# Altium project StratoChovy.PrjPcb (part 2 of 2)

## Sheet GPS.SchDoc
size A
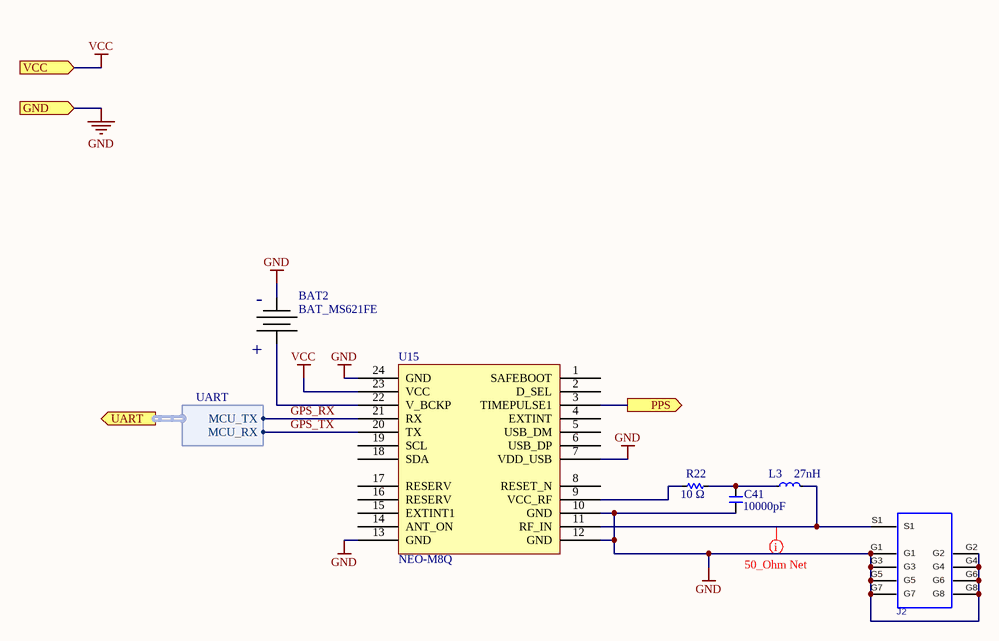
[diagram p6: GPS.SchDoc]

### Parts
BAT2  BAT_MS621FE  [BATT_COINCELL_RECHARGEABLE]
C41  Capacitance (shorthand): 10000pF  [C0603]  (hidden comment: 490-1512-1-ND)
J2  SMA-J-P-X-ST-EM2  [SMA-J-P-X-ST-EM1]  (value not drawn)
L3  Inductance: 27nH  [R0402]  (hidden comment: 490-15373-1-ND)
R22  Resistance: 10 Ω  [R0603]  (hidden comment: 311-10.0HRCT-ND)
U15  NEO-M8Q  [NEO_M8]

### Ports
GND (in), PPS (out), UART (out, harness UART), VCC (in)

### Harnesses
UART: MCU_RX, MCU_TX

### Nets
GND: BAT2.- C41.1 J2.G1 J2.G2 J2.G3 J2.G4 J2.G5 J2.G6 J2.G7 J2.G8 U15.7(VDD_USB) U15.10(GND) U15.12(GND) U15.13(GND) U15.24(GND) ; port GND
VCC: U15.23(VCC) ; port VCC  [project net 3V3]
GPS_RX: U15.21(RX) ; port UART.MCU_TX
GPS_TX: U15.20(TX) ; port UART.MCU_RX
PPS: U15.3(TIMEPULSE1) ; port PPS
NetBAT2_+: BAT2.+ U15.22(V_BCKP)
NetC41_2: C41.2 L3.1 R22.2
NetJ2_S1: J2.S1 L3.2 U15.11(RF_IN)
NetR22_1: R22.1 U15.9(VCC_RF)

Not connected (* = marked no-connect by the designer): U15 1(SAFEBOOT) 2(D_SEL) 4(EXTINT) 5(USB_DM) 6(USB_DP) 8(RESET_N) 14(ANT_ON) 15(EXTINT1) 16(RESERV) 17(RESERV) 18(SDA) 19(SCL)

### Layout directives
rule Clearance Constraint [Generic clearance = 0mil, and 21 value(s) for objects]: NetJ2_S1

### Library data of the parts
BAT2 = CMP-060-0000-1: MS621FE RECHARGEABLE COIN CELL BACKUP; Manufacturer: Seiko Instruments; Manufacturer Part Number: MS621FE-FL11E; Battery Chemistry: Lithium; Battery Cell Size: Coin, 6.8mm; Capacity: 5.5mAh; Discharge Rate: 15µA; Shipping Info: Due to restrictions, only ground shipment is allowed.; RoHS: RoHS Compliant; Stock 1: 41059; Pricing 1: 1=2.04, 10=1.838, 50=1.6338, 100=1.4296, 250=1.30704, 500=1.22534, 1000=1.09051, 2500=1.0112, 5000=0.99138 (USD); Part Status: Active; Size / Dimension: 0.27" Dia x 0.08" H (6.8mm x 2.1mm); Termination Style: SMD (SMT) Tab; Standard Charge Current: 15µA; Standard Charge Time: -; Weight: 0.23g; ComponentLink1URL: http://www.sii.co.jp/en/me/files/2017/04/MicroBatteryCatalogue-E_2017_web.pdf; ComponentLink1Description: http://www.sii.co.jp/en/me/files/2017/04/MicroBatteryCatalogue-E_2017_web.pdf; Design Item ID: BAT_MS621FE; Source: miscellaneous.SchLib
C41 = CMP-119-0053-1: CAP CER 0603 10000pF X7R 50V 10%; Manufacturer: Murata Electronics North America; Capacitance - pF (Machine readable): #NAME?; Rated Voltage: 50V; Dielectric: X7R
J2 = CMP-025-0000-1: SMA Samtec, Edge Mount, Long Thread. PCB Footprint designed by timv to improve strength, verifived on several PCBs from BAC.
L3 = CMP-123-0062-1: FIXED IND 27NH 680MA 288 MOHM; Manufacturer: Murata Electronics North America; Frequency - Self Resonant: 4GHz; Inductance - nH (Machine readable): 27; Current Rating: 680mA
R22 = CMP-126-0002-2: RES SMD 10 OHM 1% 1/10W 0603; Manufacturer: Yageo; Manufacturer Part Number: RC0603FR-0710RL; Temperature Coefficient: ±200ppm/°C; Resistance (Sortable): 10; Power (Watts): 0.1W, 1/10W; Tolerance: ±1%; Operating Temperature: -55°C ~ 155°C; Image: //media.digikey.com/Renders/Yageo%20Renders/0603-(1608-Metric).jpg; Datasheets: http://www.yageo.com/documents/recent/PYu-RC_Group_51_RoHS_L_9.pdf
U15 = CMP-074-0003-2: Receiver GNSS 24LCC; Design Item ID: NEO_M8; Source: sensor.SchLib

## Sheet COTS_Altimeter.SchDoc
size A3
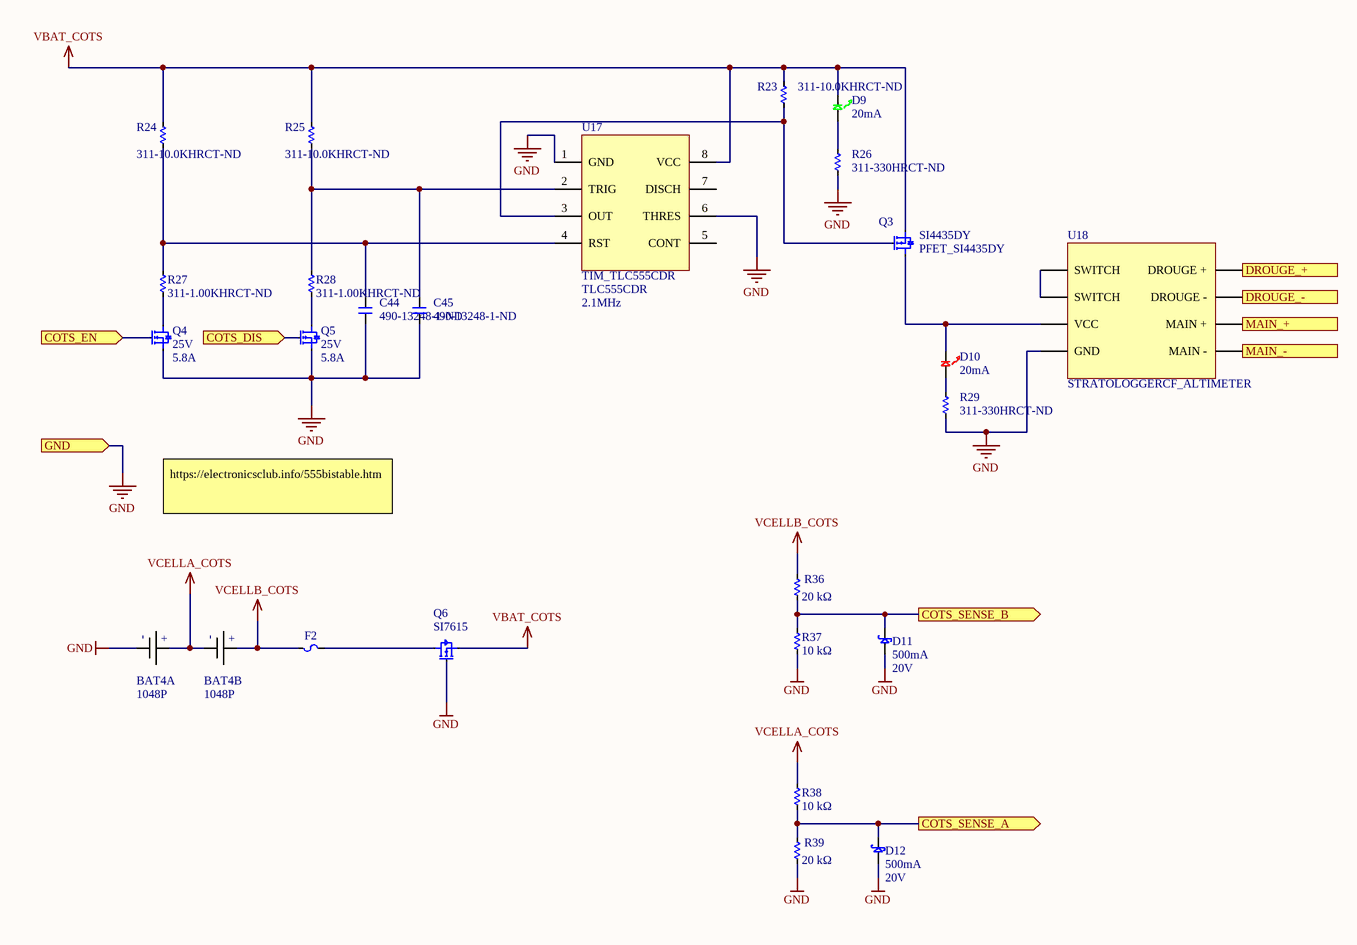
[diagram p7: COTS_Altimeter.SchDoc]

### Parts
(Parts that share a designator on the sheet are numbered #1, #2 ... from top to bottom, then left to right.)
BAT4  Manufacturer Part Number: 1048P  [BATT_18650_KEYSTONE_1048]  (hidden comment: BATT_Clip_Li-Ion_2x)  (parts A,B of 2)
C44  490-13248-1-ND  [C0603]
C45#1  490-13248-1-ND  [C0603]
D9  Current - Test: 20mA  [0805_Diode]  (hidden comment: LED_LY971)
D10  Current - Test: 20mA  [0805_Diode]  (hidden comment: LED_LY974)
D11  Current - Average Rectified (Io): 500mA  Voltage - DC Reverse (Vr) (Max): 20V  [SOD123]  (hidden comment: SCHOTTKY_MBR0520L)
D12  Current - Average Rectified (Io): 500mA  Voltage - DC Reverse (Vr) (Max): 20V  [SOD123]  (hidden comment: SCHOTTKY_MBR0520L)
F2  __template_fuse  [R1206]  (value not drawn)
Q3  PFET_SI4435DY  Manufacturer Part Number: SI4435DY  [8SOIC300]
Q4  Drain to Source Voltage (Vdss): 25V  Current - Continuous Drain (Id) @ 25° C: 5.8A  [3SOT23]  (hidden comment: NFET_IRFML8244TRPBF)
Q5  Drain to Source Voltage (Vdss): 25V  Current - Continuous Drain (Id) @ 25° C: 5.8A  [3SOT23]  (hidden comment: NFET_IRFML8244TRPBF)
Q6  SI7615  [POWERPAK_1212-8_SINGLE]
R23  311-10.0KHRCT-ND  [R0603]
R24  311-10.0KHRCT-ND  [R0603]
R25  311-10.0KHRCT-ND  [R0603]
R26  311-330HRCT-ND  [R0603]
R27  311-1.00KHRCT-ND  [R0603]
R28  311-1.00KHRCT-ND  [R0603]
R29  311-330HRCT-ND  [R0603]
R36  Resistance: 20 kΩ  [R0603]  (hidden comment: 311-20.0KHRCT-ND)
R37  Resistance: 10 kΩ  [R0603]  (hidden comment: 311-10.0KHRCT-ND)
R38  Resistance: 10 kΩ  [R0603]  (hidden comment: 311-10.0KHRCT-ND)
R39  Resistance: 20 kΩ  [R0603]  (hidden comment: 311-20.0KHRCT-ND)
U17  TIM_TLC555CDR  Manufacturer Part Number: TLC555CDR  Frequency: 2.1MHz  [8SOIC390]
U18#1  STRATOLOGGERCF_ALTIMETER  [STRATOLOGGER_ALTIMETER]

### Ports
COTS_DIS (in), COTS_EN (in), COTS_SENSE_A (out), COTS_SENSE_B (out), DROUGE_+ (out), DROUGE_- (out), GND (in), MAIN_+ (out), MAIN_- (out)

### Nets
GND: BAT4.CELL1- C44.2 C45#1.2 D11.1 D12.1 Q4.2 Q5.2 Q6.4 R26.1 R29.1 R37.1 R39.1 U17.1(GND) U17.6(THRES) U18#1.5(GND) ; port GND
VBAT_COTS: D9.1 Q3.1,2,3 Q6.1 R23.2 R24.2 R25.2 U17.8(VCC)
VCELLA_COTS: BAT4.CELL1+ BAT4.CELL2- R38.2
VCELLB_COTS: BAT4.CELL2+ F2.1 R36.2
COTS_DIS: Q5.1 ; port COTS_DIS
COTS_EN: Q4.1 ; port COTS_EN
COTS_SENSE_A: D12.2 R38.1 R39.2 ; port COTS_SENSE_A
COTS_SENSE_B: D11.2 R36.1 R37.2 ; port COTS_SENSE_B
DROUGE_+: U18#1.4(DROUGE_+) ; port DROUGE_+
DROUGE_-: U18#1.3(DROUGE_-) ; port DROUGE_-
MAIN_+: U18#1.2(MAIN_+) ; port MAIN_+
MAIN_-: U18#1.1(MAIN_-) ; port MAIN_-
NetC44_1: C44.1 R24.1 R27.2 U17.4(RST)
NetC45#1_1: C45#1.1 R25.1 R28.2 U17.2(TRIG)
NetD9_2: D9.2 R26.2
NetD10_1: D10.1 Q3.5,6,7,8 U18#1.6(VCC)
NetD10_2: D10.2 R29.2
NetF2_2: F2.2 Q6.5
NetQ3_4: Q3.4 R23.1 U17.3(OUT)
NetQ4_3: Q4.3 R27.1
NetQ5_3: Q5.3 R28.1
NetU18#1_7: U18#1.7(SWITCH) U18#1.8(SWITCH)

Not connected (* = marked no-connect by the designer): U17 5(CONT) 7(DISCH)

### Notes on the sheet
- https://electronicsclub.info/555bistable.htm
- (in symbol CMP-030-0028-1, part A) +
- (in symbol CMP-030-0028-1, part B) +

### Library data of the parts
BAT4 = CMP-030-0028-1: Dual Lithium Ion Cell Holder; Manufacturer: Keystone Electronics; Number of Cells: 2; Battery Type, Function: Cylindrical, Holder; Battery Cell Size: 18650; Style: Holder (Open); ComponentLink1URL: http://www.keyelco.com/product-pdf.cfm?p=13959; Battery Series: -; RoHS: RoHS Compliant; Height Above Board: 0.585" (14.86mm); Design Item ID: BATT_Clip_Li-Ion_2x; Mounting Type: PCB, Surface Mount; Termination Style: SMD (SMT) Tab; Source: connector.SchLib; Stock 1: 759; Pricing 1: 1=4.81, 10=4.007, 50=3.506, 100=3.339, 250=2.92164, 500=2.83816, 1000=2.42078, 2500=2.25382, 5000=2.24047 (USD); ComponentLink1Description: http://www.keyelco.com/product-pdf.cfm?p=13959; Operating Temperature: -50°C ~ 145°C
C44 C45#1 = CMP-119-0071-1: CAP CER 10UF 35V X5R 0603 20%; Manufacturer: Murata Electronics North America; Capacitance - pF (Machine readable): #NAME?; Capacitance (shorthand): 10µF; Rated Voltage: 35V; Dielectric: X5R
D9 = CMP-033-0000-1: LED 0805 GREEN 20MA; Manufacturer Part Number: LG R971-KN-1; Manufacturer: OSRAM Opto Semiconductors Inc; Lens Color: White; Wavelength - Peak: 572nm; Lens Style/Size: Rectangle with Flat Top, 1.30mm x 1.25mm; Voltage - Forward (Vf) (Typ): 2.2V; Lens Transparency: Diffused; Wavelength - Dominant: 570nm; Millicandela Rating: 26.05mcd; Viewing Angle: 160°; Source: diode.SchLib; RoHS: RoHS Compliant; ComponentLink1URL: http://www.osram-os.com/Graphics/XPic9/00078860_0.pdf; Mounting Type: Surface Mount; ComponentLink1Description: http://www.osram-os.com/Graphics/XPic9/00078860_0.pdf; Packaging: Cut Tape (CT); Supplier Device Package: *; Package / Case: 0805 (2012 Metric); Design Item ID: LED_LY971; Size / Dimension: 2.00mm L x 1.25mm W; Pricing 1: 1=0.08, 10=0.069, 100=0.0548, 250=0.04796, 500=0.04384 (USD); Stock 1: 89733; Height (Max): 0.80mm; Color: Green
D10 = CMP-033-0001-1: LED 0805 RED 20MA; Manufacturer Part Number: LH R974-LP-1; Manufacturer: OSRAM Opto Semiconductors Inc; Millicandela Rating: 41mcd; Lens Style/Size: Rectangle with Flat Top, 1.30mm x 1.25mm; Wavelength - Peak: 660nm; Lens Transparency: Diffused; Wavelength - Dominant: 645nm; Viewing Angle: 160°; Voltage - Forward (Vf) (Typ): 1.8V; Lens Color: White; Mounting Type: Surface Mount; ComponentLink1Description: http://www.osram-os.com/Graphics/XPic8/00078869_0.pdf; Pricing 1: 1=0.08, 10=0.07, 100=0.0559, 250=0.04892, 500=0.04472 (USD); Packaging: Cut Tape (CT); Size / Dimension: 2.00mm L x 1.25mm W; Design Item ID: LED_LY974; Stock 1: 66379; Package / Case: 0805 (2012 Metric); ComponentLink1URL: http://www.osram-os.com/Graphics/XPic8/00078869_0.pdf; RoHS: RoHS Compliant; Color: Red; Supplier Device Package: *; Height (Max): 0.80mm; Source: diode.SchLib
D11 D12 = CMP-033-0037-1: DIODE SCHOTTKY 0.5A 20V SOD-123; Manufacturer: Fairchild Semiconductor; Speed: Fast Recovery =< 500ns, > 200mA (Io); Current - Reverse Leakage @ Vr: 250µA @ 20V; Voltage - Forward (Vf) (Max) @ If: 385mV @ 500mA; Manufacturer Part Number: MBR0520L; RoHS: RoHS Compliant; Stock 1: 217232; Pricing 1: 1=0.63, 10=0.43, 100=0.2024, 250=0.1442, 500=0.11006, 750=0.08603, 1000=0.0759 (USD); Diode Type: Schottky; Reverse Recovery Time (trr): -; Capacitance @ Vr, F: -; Mounting Type: Surface Mount; Package / Case: SOD-123; Supplier Device Package: SOD-123; Packaging: Cut Tape (CT); ComponentLink1URL: http://www.fairchildsemi.com/ds/MB/MBR0520L.pdf; ComponentLink1Description: Datasheet; Design Item ID: SCHOTTKY_MBR0520L; Source: diode.SchLib
F2 = CMP-035-0003-1: Source: fuse.SchLib; Design Item ID: __template_fuse
Q3 = CMP-078-0013-1: MOSFET P-CH 30V 8.8A; Manufacturer: Fairchild Semiconductor; Drain to Source Resistance: 20mR; Current Rating: -8.8A; Fall Time: 25ns; Number of Elements: 1; Nominal Vgs: -1.7V; Turn-Off Delay Time: 42ns; Voltage Rating (DC): -30V; Max Power Dissipation: 2.5W; Rise Time: 13.5ns; Gate to Source Voltage (Vgs): 20V; Input Capacitance: 1.604nF; Element Configuration: Single; Turn-On Delay Time: 16ns; Length: 4.9mm; Case/Package: SOIC; Continuous Drain Current (ID): 8.8A; Lead Free: Lead Free; Stock 1: 5038; Width: 3.9mm; Pricing 1: 1=0.99, 10=0.884, 100=0.6893, 500=0.5694, 1000=0.4495 (USD); ComponentLink5Description: https://datasheet.ciiva.com/16772/si4435dy-16772219.pdf; ComponentLink1Description: https://datasheet.ciiva.com/4450/si4435dy-100561-4450691.pdf; ComponentLink7Description: https://datasheet.ciiva.com/6374/si4435dy-6374703.pdf; Threshold Voltage: -1.7V; Max Operating Temperature: 175°C; Package Quantity: 1; Packaging: Tape and Reel; Height: 1.57mm; ComponentLink3Description: https://datasheet.ciiva.com/26252/si4435dy-26252714.pdf; ComponentLink7URL: https://datasheet.ciiva.com/6374/si4435dy-6374703.pdf; Drain to Source Voltage (Vdss): 30V; Dual Supply Voltage: -30V; ComponentLink2Description: https://datasheet.ciiva.com/22682/256483-22682026.pdf; Radiation Hardening: No; Rds On Max: 20mR; REACH SVHC: No SVHC; ComponentLink3URL: https://datasheet.ciiva.com/26252/si4435dy-26252714.pdf; ComponentLink6URL: https://datasheet.ciiva.com/6374/si4435dy-6374700.pdf; ComponentLink4Description: https://datasheet.ciiva.com/11175/si4435dy-11175899.pdf; ComponentLink4URL: https://datasheet.ciiva.com/11175/si4435dy-11175899.pdf; ComponentLink2URL: https://datasheet.ciiva.com/22682/256483-22682026.pdf; Source: transistor_fet.SchLib; ComponentLink6Description: https://datasheet.ciiva.com/6374/si4435dy-6374700.pdf; Number of Pins: 8; ComponentLink5URL: https://datasheet.ciiva.com/16772/si4435dy-16772219.pdf; Drain to Source Breakdown Voltage: -30V; Power Dissipation: 2.5W; Mount: Surface Mount; ComponentLink1URL: https://datasheet.ciiva.com/4450/si4435dy-100561-4450691.pdf; Termination: SMD/SMT; Design Item ID: PFET_SI4435DY; Min Operating Temperature: -55°C
Q4 Q5 = CMP-078-0046-1: MOSFET N-CH 25V 5.8A SOT23; Manufacturer: International Rectifier; FET Type: MOSFET N-Channel, Metal Oxide; FET Feature: Logic Level Gate; Rds On (Max) @ Id, Vgs: 24 mOhm @ 5.8A, 10V; Vgs(th) (Max) @ Id: 2.35V @ 10µA; Gate Charge (Qg) @ Vgs: 5.4nC @ 10V; Input Capacitance (Ciss) @ Vds: 430pF @ 10V; Power - Max: 1.25W; Manufacturer Part Number: IRFML8244TRPBF; RoHS: RoHS Compliant; Stock 1: 13542; Pricing 1: 1=0.41, 10=0.23, 100=0.1491, 250=0.13548, 500=0.1219, 1000=0.11411 (USD); Mounting Type: Surface Mount; Package / Case: TO-236-3, SC-59, SOT-23-3; Supplier Device Package: SOT-23; Packaging: Cut Tape (CT); ComponentLink1URL: http://www.irf.com/product-info/datasheets/data/irfml8244pbf.pdf; ComponentLink1Description: Datasheet; Design Item ID: NFET_IRFML8244TRPBF; Source: transistor_fet.SchLib
Q6 = CMP-078-0043-2: MOSFET P-CH 20V 35A PPK; Manufacturer: Vishay Siliconix; Manufacturer Part Number: SI7615ADN-T1-GE3; FET Type: MOSFET P-Channel, Metal Oxide; FET Feature: Standard; Current - Continuous Drain (Id) @ 25°C: 35A (Tc); Rds On (Max) @ Id, Vgs: 4.4 mOhm @ 20A, 10V; Vgs(th) (Max) @ Id: 1.5V @ 250µA; Gate Charge (Qg) @ Vgs: 183nC @ 10V; Input Capacitance (Ciss) @ Vds: 5590pF @ 10V; Power - Max: 52W; RoHS: RoHS Compliant; Stock 1: 98451; Pricing 1: 1=0.73, 10=0.646, 25=0.6068, 100=0.4951, 250=0.45988, 500=0.3914, 1000=0.31312 (USD); Packaging: Cut Tape (CT); Part Status: Active; Drain to Source Voltage (Vdss): 20V; Operating Temperature: -55°C ~ 150°C (TJ); Mounting Type: Surface Mount; Package / Case: PowerPAK® 1212-8; Supplier Device Package: PowerPAK® 1212-8; ComponentLink1URL: http://www.vishay.com/docs/62667/si7615adn.pdf; ComponentLink1Description: http://www.vishay.com/docs/62667/si7615adn.pdf; Source: transistor_fet.SchLib; Design Item ID: PFET_SI7615ADN-T1
R23-R25 = CMP-126-0273-2: RES SMD 10K OHM 1% 1/10W 0603; Manufacturer Part Number: RC0603FR-0710KL; Manufacturer: Yageo; Power (Watts): 0.1W, 1/10W; Temperature Coefficient: ±100ppm/°C; Resistance: 10 kΩ; Resistance (Sortable): 10000; Tolerance: ±1%; Operating Temperature: -55°C ~ 155°C; Datasheets: http://www.yageo.com/documents/recent/PYu-RC_Group_51_RoHS_L_9.pdf; Image: //media.digikey.com/Renders/Yageo%20Renders/0603-(1608-Metric).jpg
R26 R29 = CMP-126-0120-2: RES SMD 330 OHM 1% 1/10W 0603; Manufacturer: Yageo; Manufacturer Part Number: RC0603FR-07330RL; Temperature Coefficient: ±100ppm/°C; Resistance (Sortable): 330; Resistance: 330 Ω; Power (Watts): 0.1W, 1/10W; Tolerance: ±1%; Datasheets: http://www.yageo.com/documents/recent/PYu-RC_Group_51_RoHS_L_9.pdf; Operating Temperature: -55°C ~ 155°C; Image: //media.digikey.com/Renders/Yageo%20Renders/0603-(1608-Metric).jpg
R27 R28 = CMP-126-0172-2: RES SMD 1K OHM 1% 1/10W 0603; Manufacturer: Yageo; Manufacturer Part Number: RC0603FR-071KL; Power (Watts): 0.1W, 1/10W; Resistance (Sortable): 1000; Resistance: 1 kΩ; Temperature Coefficient: ±100ppm/°C; Image: //media.digikey.com/Renders/Yageo%20Renders/0603-(1608-Metric).jpg; Operating Temperature: -55°C ~ 155°C; Tolerance: ±1%; Datasheets: http://www.yageo.com/documents/recent/PYu-RC_Group_51_RoHS_L_9.pdf
R36 R39 = CMP-126-0304-2: RES SMD 20K OHM 1% 1/10W 0603; Manufacturer Part Number: RC0603FR-0720KL; Manufacturer: Yageo; Resistance (Sortable): 20000; Power (Watts): 0.1W, 1/10W; Temperature Coefficient: ±100ppm/°C; Datasheets: http://www.yageo.com/documents/recent/PYu-RC_Group_51_RoHS_L_9.pdf; Image: //media.digikey.com/Renders/Yageo%20Renders/0603-(1608-Metric).jpg; Tolerance: ±1%; Operating Temperature: -55°C ~ 155°C
R37 R38 = CMP-126-0273-2: RES SMD 10K OHM 1% 1/10W 0603; Manufacturer Part Number: RC0603FR-0710KL; Manufacturer: Yageo; Resistance (Sortable): 10000; Power (Watts): 0.1W, 1/10W; Temperature Coefficient: ±100ppm/°C; Datasheets: http://www.yageo.com/documents/recent/PYu-RC_Group_51_RoHS_L_9.pdf; Image: //media.digikey.com/Renders/Yageo%20Renders/0603-(1608-Metric).jpg; Tolerance: ±1%; Operating Temperature: -55°C ~ 155°C
U17 = CMP-059-0002-1: 555 Type, Timer/Oscillator (Single) IC 2.1MHz 8-SOIC (0.154", 3.90mm Width); Manufacturer: Texas Instruments; Current - Supply: 360µA; Voltage - Supply: 2 V ~ 15 V; Package / Case: 8-SOIC (0.154", 3.90mm Width); ComponentLink1Description: http://www.ti.com/lit/ds/symlink/tlc555.pdf; Mounting Type: Surface Mount; ComponentLink1URL: http://www.ti.com/lit/ds/symlink/tlc555.pdf; Operating Temperature: 0°C ~ 70°C; Design Item ID: TIM_TLC555CDR; Stock 1: 16901; Source: miscellaneous.SchLib; Count: -; Part Status: Active; Supplier Device Package: 8-SOIC; Packaging: Cut Tape (CT); Pricing 1: 1=0.72, 10=0.629, 100=0.481, 500=0.3811, 1000=0.30525 (USD); RoHS: RoHS Compliant
U18#1 = CMP-064-0039-2: Stratologger; Source: modules.SchLib; Design Item ID: STRATOLOGGERCF_ALTIMETER

## Sheet Radio.SchDoc
size A
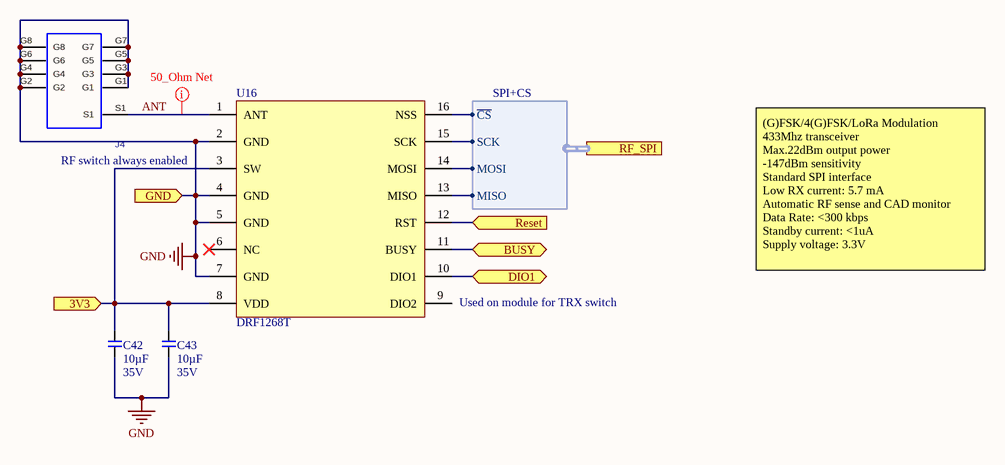
[diagram p8: Radio.SchDoc]

### Parts
C42  Capacitance (shorthand): 10µF  Rated Voltage: 35V  [C0603]  (hidden comment: 490-13248-1-ND)
C43  Capacitance (shorthand): 10µF  Rated Voltage: 35V  [C0603]  (hidden comment: 490-13248-1-ND)
J4  SMA-J-P-X-ST-EM2  [SMA-J-P-X-ST-EM1]  (value not drawn)
U16  DRF1268T  [DRF1268T]

### Ports
3V3 (in), BUSY (bidir), DIO1 (bidir), GND (in), Reset (in), RF_SPI (harness SPI+CS)

### Harnesses
SPI+CS: SCK, MOSI, MISO, ~{CS}

### Nets
3V3: C42.1 C43.1 U16.3(SW) U16.8(VDD) ; port 3V3
GND: C42.2 C43.2 J4.G1 J4.G2 J4.G3 J4.G4 J4.G5 J4.G6 J4.G7 J4.G8 U16.2(GND) U16.4(GND) U16.5(GND) U16.7(GND) ; port GND
ANT: J4.S1 U16.1(ANT)
RF_BUSY: U16.11(BUSY) ; port BUSY
RF_DIO1: U16.10(DIO1) ; port DIO1
RF_NRESET: U16.12(RST) ; port Reset
NetU13_35: U16.14(MOSI) ; port RF_SPI.MOSI
NetU13_36: U16.15(SCK) ; port RF_SPI.SCK
NetU13_37: U16.13(MISO) ; port RF_SPI.MISO
NetU13_38: U16.16(NSS) ; port RF_SPI.~{CS}

Not connected (* = marked no-connect by the designer): U16 6(NC)* 9(DIO2)

### Layout directives
rule Clearance Constraint [Generic clearance = 0mil, and 21 value(s) for objects]: ANT

### Notes on the sheet
- RF switch always enabled
- (G)FSK/4(G)FSK/LoRa Modulation
  433Mhz transceiver
  Max.22dBm output power
  -147dBm sensitivity
  Standard SPI interface
  Low RX current: 5.7 mA
  Automatic RF sense and CAD monitor
  Data Rate: <300 kbps
  Standby current: <1uA
  Supply voltage: 3.3V
- (near U16) Used on module for TRX switch

### Library data of the parts
C42 C43 = CMP-119-0071-1: as C12 on sheet Sensors; Dielectric: X5R
J4 = CMP-025-0000-1: as J2 on sheet GPS
U16 = CMP-025-0002-1: Dorji DRF1268T LoRa Module with SX1262 IC and TCXO; Design Item ID: RFM_Module

## Sheet MC33797.SchDoc: Top Sheet
size A4; Project: World Domination Satellite
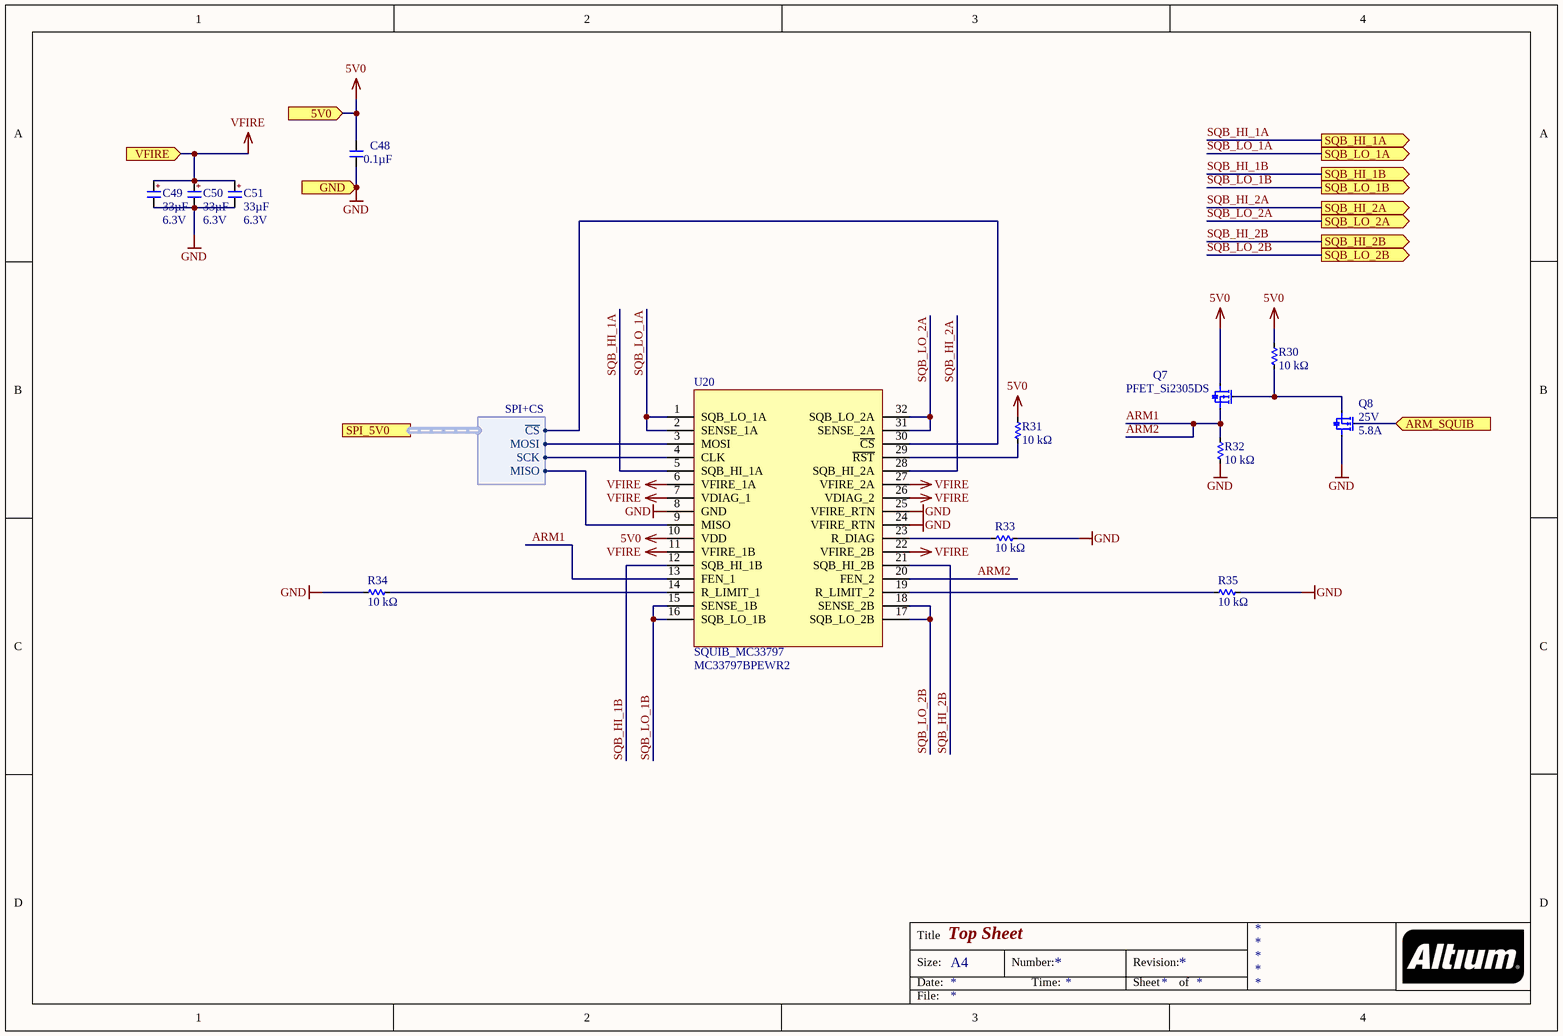
[diagram p9: MC33797.SchDoc]

### Parts
C48  Capacitance: 0.1µF  [C0603]  (hidden comment: CAP_CER_100NF_100V)
C49  Capacitance: 33µF  Voltage - Rated: 6.3V  [C1206P]  (hidden comment: CAP_TANT_33UF)
C50  Capacitance: 33µF  Voltage - Rated: 6.3V  [C1206P]  (hidden comment: CAP_TANT_33UF)
C51  Capacitance: 33µF  Voltage - Rated: 6.3V  [C1206P]  (hidden comment: CAP_TANT_33UF)
Q7  PFET_Si2305DS  [3SOT23]
Q8  Drain to Source Voltage (Vdss): 25V  Current - Continuous Drain (Id) @ 25° C: 5.8A  [3SOT23]  (hidden comment: NFET_IRFML8244TRPBF)
R30  Resistance: 10 kΩ  [R0603]  (hidden comment: 311-10.0KHRCT-ND)
R31  Resistance: 10 kΩ  [R0603]  (hidden comment: 311-10.0KHRCT-ND)
R32  Resistance: 10 kΩ  [R0603]  (hidden comment: 311-10.0KHRCT-ND)
R33  Resistance: 10 kΩ  [R0603]  (hidden comment: 311-10.0KHRCT-ND)
R34  Resistance: 10 kΩ  [R0603]  (hidden comment: 311-10.0KHRCT-ND)
R35  Resistance: 10 kΩ  [R0603]  (hidden comment: 311-10.0KHRCT-ND)
U20  SQUIB_MC33797  Manufacturer Part Number: MC33797BPEWR2  [SOT1762-1]

### Ports
5V0 (in), ARM_SQUIB (in), GND (in), SPI_5V0 (harness SPI+CS), SQB_HI_1A (out), SQB_HI_1B (out), SQB_HI_2A (out), SQB_HI_2B (out), SQB_LO_1A (out), SQB_LO_1B (out), SQB_LO_2A (out), SQB_LO_2B (out), VFIRE (in)

### Harnesses
SPI+CS: ~{CS}, SCK, MOSI, MISO

### Nets
5V0: C48.1 Q7.3 R30.2 R31.2 U20.10(VDD) ; port 5V0
GND: C48.2 C49.2 C50.2 C51.2 Q8.3 R32.1 R33.2 R34.1 R35.2 U20.8(GND) U20.24(VFIRE_RTN) U20.25(VFIRE_RTN) ; port GND
VFIRE: C49.1 C50.1 C51.1 U20.6(VFIRE_1A) U20.7(VDIAG_1) U20.11(VFIRE_1B) U20.22(VFIRE_2B) U20.26(VDIAG_2) U20.27(VFIRE_2A) ; port VFIRE  [project net VBAT]
ARM1: Q7.2 R32.2 U20.13(FEN_1) U20.20(FEN_2)  [also labelled ARM2]
ARM_SQUIB: Q8.1 ; port ARM_SQUIB
SQB_HI_1A: U20.5(SQB_HI_1A) ; port SQB_HI_1A
SQB_HI_1B: U20.12(SQB_HI_1B) ; port SQB_HI_1B
SQB_HI_2A: U20.28(SQB_HI_2A) ; port SQB_HI_2A
SQB_HI_2B: U20.21(SQB_HI_2B) ; port SQB_HI_2B
SQB_LO_1A: U20.1(SQB_LO_1A) U20.2(SENSE_1A) ; port SQB_LO_1A
SQB_LO_1B: U20.15(SENSE_1B) U20.16(SQB_LO_1B) ; port SQB_LO_1B
SQB_LO_2A: U20.31(SENSE_2A) U20.32(SQB_LO_2A) ; port SQB_LO_2A
SQB_LO_2B: U20.17(SQB_LO_2B) U20.18(SENSE_2B) ; port SQB_LO_2B
NetQ7_1: Q7.1 Q8.2 R30.1
NetR31_1: R31.1 U20.29(~{RST})
NetR33_1: R33.1 U20.23(R_DIAG)
NetR34_2: R34.2 U20.14(R_LIMIT_1)
NetR35_1: R35.1 U20.19(R_LIMIT_2)
NetU18#2_10: U20.3(MOSI) ; port SPI_5V0.MOSI
NetU18#2_11: U20.4(CLK) ; port SPI_5V0.SCK
NetU18#2_12: U20.9(MISO) ; port SPI_5V0.MISO
NetU18#2_13: U20.30(~{CS}) ; port SPI_5V0.~{CS}

### Notes on the sheet
- Title
- Size:
- Date:
- A4
- Number:
- Time:
- Revision:
- Sheet
- of
- File:
- (in symbol CMP-026-0002-1) +

### Library data of the parts
C48 = CMP-027-0018-1: CAP CER 0.1UF 100V X7S 0603; Manufacturer: TDK Corporation; Manufacturer Part Number: C1608X7S2A104K080AB; Tolerance: ±10%; Failure Rate: -; Mounting Type: Surface Mount, MLCC; Pricing 1: 1=0.19, 10=0.133, 100=0.0673, 500=0.04604, 1000=0.04073 (USD); RoHS: RoHS Compliant; ComponentLink1Description: https://product.tdk.com/info/en/catalog/datasheets/mlcc_commercial_midvoltage_en.pdf; Features: -; Design Item ID: CAP_CER_100NF_100V; Lead Spacing: -; Source: capacitor.SchLib; Packaging: Cut Tape (CT); Lead Style: -; Ratings: -; Part Status: Active; Temperature Coefficient: X7S; Operating Temperature: -55°C ~ 125°C; ComponentLink1URL: https://product.tdk.com/info/en/catalog/datasheets/mlcc_commercial_midvoltage_en.pdf; Stock 1: 662530; Size / Dimension: 0.063" L x 0.031" W (1.60mm x 0.80mm); Voltage - Rated: 100V; Applications: General Purpose; Package / Case: 0603 (1608 Metric); Thickness (Max): 0.037" (0.95mm); Height - Seated (Max): -
C49-C51 = CMP-026-0002-1: Manufacturer: AVX Corporation; Manufacturer Part Number: TPSA336K006R0600; Manufacturer Size Code: A; Tolerance: ±10%; ESR (Equivalent Series Resistance): 600 mOhm; RoHS: RoHS Compliant; Packaging: Cut Tape (CT); Part Status: Active; Operating Temperature: -55°C ~ 125°C; Features: General Purpose; Mounting Type: Surface Mount; Package / Case: 1206 (3216 Metric); Size / Dimension: 0.126" L x 0.063" W (3.20mm x 1.60mm); Height - Seated (Max): 0.071" (1.80mm); Lead Spacing: -; Lifetime @ Temp.: -; ComponentLink1URL: http://datasheets.avx.com/TPS.pdf; Stock 1: 27700; ComponentLink1Description: http://datasheets.avx.com/TPS.pdf; Pricing 1: 1=0.52, 10=0.371, 25=0.3168, 50=0.2806, 100=0.2444, 250=0.20816, 500=0.181, 1000=0.15385 (USD); Design Item ID: CAP_TANT_33UF; Failure Rate: -; Source: capacitor.SchLib
Q7 = CMP-078-0012-1: MOSFET P-CH; Design Item ID: PFET_Si2305DS; Source: transistor_fet.SchLib
Q8 = CMP-078-0046-1: as Q4 on sheet COTS_Altimeter; Manufacturer Part Number: IRFML8244TRPBF; RoHS: RoHS Compliant; Stock 1: 13542; Pricing 1: 1=0.41, 10=0.23, 100=0.1491, 250=0.13548, 500=0.1219, 1000=0.11411 (USD); Mounting Type: Surface Mount; Package / Case: TO-236-3, SC-59, SOT-23-3; Supplier Device Package: SOT-23; Packaging: Cut Tape (CT); ComponentLink1URL: http://www.irf.com/product-info/datasheets/data/irfml8244pbf.pdf; ComponentLink1Description: Datasheet; Design Item ID: NFET_IRFML8244TRPBF; Source: transistor_fet.SchLib
R30-R35 = CMP-126-0273-2: as R37 on sheet COTS_Altimeter; Datasheets: http://www.yageo.com/documents/recent/PYu-RC_Group_51_RoHS_L_9.pdf; Image: //media.digikey.com/Renders/Yageo%20Renders/0603-(1608-Metric).jpg; Tolerance: ±1%; Operating Temperature: -55°C ~ 155°C
U20 = CMP-045-0005-1: Manufacturer: NXP USA Inc.; Interface: SPI; Voltage - Supply: 4.75 V ~ 5.25 V; RoHS: RoHS Compliant; Packaging: Cut Tape (CT); Part Status: Active; Applications: -; Package / Case: 32-SOIC (0.295", 7.50mm Width); Supplier Device Package: 32-SOIC; Mounting Type: Surface Mount; ComponentLink1URL: http://cache.freescale.com/files/analog/doc/data_sheet/MC33797.pdf; ComponentLink1Description: http://cache.freescale.com/files/analog/doc/data_sheet/MC33797.pdf; Source: ic_interface.SchLib; Design Item ID: SQUIB_MC33797

## Sheet LevelShifter.SchDoc: Top Sheet
size A4; Project: World Domination Satellite
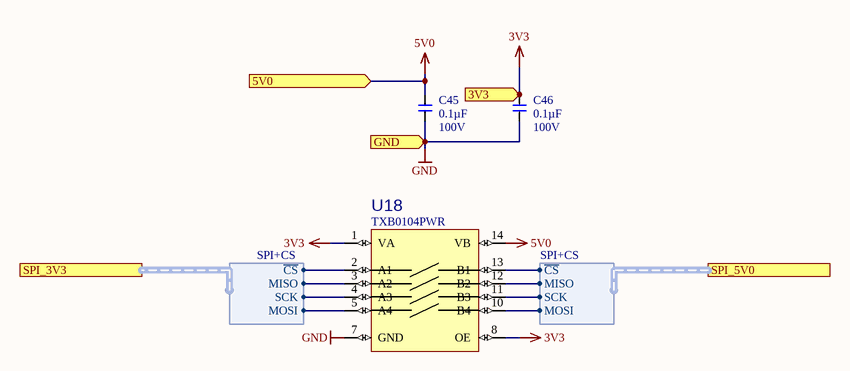
[diagram p10: LevelShifter.SchDoc]

### Parts
(Parts that share a designator on the sheet are numbered #1, #2 ... from top to bottom, then left to right.)
C45#2  Voltage - Rated: 100V  Capacitance: 0.1µF  [C0603]  (hidden comment: CAP_CER_100NF_100V)
C46  Voltage - Rated: 100V  Capacitance: 0.1µF  [C0603]  (hidden comment: CAP_CER_100NF_100V)
U18#2  Manufacturer Part Number: TXB0104PWR  [14TSSOP65]  (hidden comment: LVLSHFT_TXB0104PWR)

### Ports
3V3 (in), 5V0 (in), GND (in), SPI_3V3 (harness SPI+CS), SPI_5V0 (harness SPI+CS)

### Harnesses
SPI+CS: ~{CS}, MISO, MOSI, SCK

### Nets
3V3: C46.1 U18#2.1(VA) U18#2.8(OE) ; port 3V3
5V0: C45#2.1 U18#2.14(VB) ; port 5V0
GND: C45#2.2 C46.2 U18#2.7(GND) ; port GND
NetU13_25: U18#2.5(A4) ; port SPI_3V3.MOSI
NetU13_26: U18#2.4(A3) ; port SPI_3V3.SCK
NetU13_27: U18#2.3(A2) ; port SPI_3V3.MISO
NetU13_28: U18#2.2(A1) ; port SPI_3V3.~{CS}
NetU18#2_10: U18#2.10(B4) ; port SPI_5V0.MOSI
NetU18#2_11: U18#2.11(B3) ; port SPI_5V0.SCK
NetU18#2_12: U18#2.12(B2) ; port SPI_5V0.MISO
NetU18#2_13: U18#2.13(B1) ; port SPI_5V0.~{CS}

### Notes on the sheet
- Title
- Size:
- Date:
- A4
- Number:
- Time:
- Revision:
- Sheet
- of
- File:

### Library data of the parts
C45#2 C46 = CMP-027-0018-1: as C48 on sheet MC33797; Failure Rate: -; Mounting Type: Surface Mount, MLCC; Pricing 1: 1=0.19, 10=0.133, 100=0.0673, 500=0.04604, 1000=0.04073 (USD); RoHS: RoHS Compliant; ComponentLink1Description: https://product.tdk.com/info/en/catalog/datasheets/mlcc_commercial_midvoltage_en.pdf; Features: -; Design Item ID: CAP_CER_100NF_100V; Lead Spacing: -; Source: capacitor.SchLib; Packaging: Cut Tape (CT); Lead Style: -; Ratings: -; Part Status: Active; Temperature Coefficient: X7S; Operating Temperature: -55°C ~ 125°C; ComponentLink1URL: https://product.tdk.com/info/en/catalog/datasheets/mlcc_commercial_midvoltage_en.pdf; Stock 1: 662530; Size / Dimension: 0.063" L x 0.031" W (1.60mm x 0.80mm); Applications: General Purpose; Package / Case: 0603 (1608 Metric); Thickness (Max): 0.037" (0.95mm); Height - Seated (Max): -
U18#2 = CMP-045-0016-1: 4 Pin Bidirectional levelshifter 5v-3.3v; Manufacturer: Texas Instruments; Translator Type: Voltage Level; Number of Circuits: 1; Channels per Circuit: 4; Voltage - VCCA: 1.2 V ~ 3.6 V; Voltage - VCCB: 1.65 V ~ 5.5 V; Output Type: Tri-State, Non-Inverted; Data Rate: 100Mbps; Value: *; RoHS: RoHS Compliant; Stock 1: 16134; Pricing 1: 1=1.39, 10=1.246, 100=0.9717, 500=0.8036, 1000=0.6355 (USD); Packaging: Cut Tape (CT); Channel Type: Bidirectional; Input Signal: -; Output Signal: -; Operating Temperature: -40°C ~ 85°C (TA); Features: Auto-Direction Sensing; Mounting Type: Surface Mount; Package / Case: 14-TSSOP (0.173", 4.40mm Width); Supplier Device Package: 14-TSSOP; ComponentLink1URL: http://www.ti.com/lit/ds/symlink/txb0104.pdf; ComponentLink1Description: http://www.ti.com/lit/ds/symlink/txb0104.pdf; Source: ic_interface.SchLib; Design Item ID: LVLSHFT_TXB0104PWR

## Nets that join several sheets
3V3: Sensors (19 pins), Battery_Management (8 pins), Blink_Blink_Beep_Boop (D7.2 U2.1), SAMD51 (13 pins), SD (9 pins), GPS (U15.23), Radio (C42.1 C43.1 U16.3 U16.8), LevelShifter (C46.1 U18#2.1 U18#2.8)
5V0: MC33797 (5 pins), LevelShifter (C45#2.1 U18#2.14)
GND: StratoChovy (BAT3.-), Sensors (44 pins), Battery_Management (19 pins), Blink_Blink_Beep_Boop (5 pins), SAMD51 (23 pins), SD (C39.1 C40.2 U14.6), GPS (15 pins), COTS_Altimeter (15 pins), Radio (14 pins), MC33797 (12 pins), LevelShifter (C45#2.2 C46.2 U18#2.7)
VBACKUP: StratoChovy (BAT3.+), SAMD51 (U13.64)
VBAT: StratoChovy (D8.2), Battery_Management (7 pins), MC33797 (9 pins)
VBUS: StratoChovy (D8.1), SAMD51 (C27.1 J1.1 U12.5)
ACCEL_1_CS: Sensors (U3.14), SAMD51 (U13.12)
ACCEL_2_CS: Sensors (U5.14), SAMD51 (U13.6)
ADXL_1_CS: Sensors (U4.7), SAMD51 (U13.9)
ADXL_2_CS: Sensors (U6.7), SAMD51 (U13.3)
ARM_SQUIB: SAMD51 (U13.61), MC33797 (Q8.1)
BAT_SNS_A: Battery_Management (D2.2 R7.1 R8.2), SAMD51 (U13.62)
BAT_SNS_B: Battery_Management (D1.2 R5.1 R6.2), SAMD51 (U13.63)
BMP_1_CS: Sensors (U7.4 U7.5 U8.6), SAMD51 (U13.10)
BMP_2_CS: Sensors (U10.4 U10.5 U11.6), SAMD51 (U13.4)
BUZZER: Blink_Blink_Beep_Boop (Q2.1), SAMD51 (U13.32)
COTS_DIS: SAMD51 (U13.49), COTS_Altimeter (Q5.1)
COTS_EN: SAMD51 (U13.50), COTS_Altimeter (Q4.1)
COTS_SENSE_A: SAMD51 (U13.41), COTS_Altimeter (D12.2 R38.1 R39.2)
COTS_SENSE_B: SAMD51 (U13.51), COTS_Altimeter (D11.2 R36.1 R37.2)
DROUGE_+: StratoChovy (J3.2), COTS_Altimeter (U18#1.4)
DROUGE_-: StratoChovy (J3.13), COTS_Altimeter (U18#1.3)
GPS_RX: SAMD51 (U13.29), GPS (U15.21)
GPS_TX: SAMD51 (U13.30), GPS (U15.20)
GYRO_1_CS: Sensors (U3.5), SAMD51 (U13.11)
GYRO_2_CS: Sensors (U5.5), SAMD51 (U13.5)
LED_1: Blink_Blink_Beep_Boop (R9.1), SAMD51 (U13.60)
LED_2: Blink_Blink_Beep_Boop (R10.1), SAMD51 (U13.59)
LED_3: Blink_Blink_Beep_Boop (R11.1), SAMD51 (P1.2 U13.58)
LED_4: Blink_Blink_Beep_Boop (R12.1), SAMD51 (P1.4 R14.1 U13.57)
MAIN_+: StratoChovy (J3.1), COTS_Altimeter (U18#1.2)
MAIN_-: StratoChovy (J3.14), COTS_Altimeter (U18#1.1)
MISO: Sensors (10 pins), SAMD51 (U13.13)
MOSI: Sensors (8 pins), SAMD51 (U13.16)
NetU13_25: SAMD51 (U13.25), LevelShifter (U18#2.5)
NetU13_26: SAMD51 (U13.26), LevelShifter (U18#2.4)
NetU13_27: SAMD51 (U13.27), LevelShifter (U18#2.3)
NetU13_28: SAMD51 (U13.28), LevelShifter (U18#2.2)
NetU13_35: SAMD51 (U13.35), Radio (U16.14)
NetU13_36: SAMD51 (U13.36), Radio (U16.15)
NetU13_37: SAMD51 (U13.37), Radio (U16.13)
NetU13_38: SAMD51 (U13.38), Radio (U16.16)
NetU18#2_10: MC33797 (U20.3), LevelShifter (U18#2.10)
NetU18#2_11: MC33797 (U20.4), LevelShifter (U18#2.11)
NetU18#2_12: MC33797 (U20.9), LevelShifter (U18#2.12)
NetU18#2_13: MC33797 (U20.30), LevelShifter (U18#2.13)
PPS: SAMD51 (U13.31), GPS (U15.3)
RF_BUSY: SAMD51 (U13.43), Radio (U16.11)
RF_DIO1: SAMD51 (U13.42), Radio (U16.10)
RF_NRESET: SAMD51 (U13.44), Radio (U16.12)
SCK: Sensors (8 pins), SAMD51 (U13.14)
SD_CD: SAMD51 (U13.15), SD (R21.2 U14.CD)
SD_CLK: SAMD51 (U13.24), SD (U14.5)
SD_CMD: SAMD51 (U13.17), SD (R17.2 U14.3)
SD_DAT0: SAMD51 (U13.18), SD (R18.2 U14.7)
SD_DAT1: SAMD51 (U13.19), SD (R20.2 U14.8)
SD_DAT2: SAMD51 (U13.20), SD (R19.2 U14.1)
SD_DAT3: SAMD51 (U13.23), SD (R16.2 U14.2)
SQB_HI_1A: StratoChovy (J3.3), MC33797 (U20.5)
SQB_HI_1B: StratoChovy (J3.4), MC33797 (U20.12)
SQB_HI_2A: StratoChovy (J3.5), MC33797 (U20.28)
SQB_HI_2B: StratoChovy (J3.6), MC33797 (U20.21)
SQB_LO_1A: StratoChovy (J3.12), MC33797 (U20.1 U20.2)
SQB_LO_1B: StratoChovy (J3.11), MC33797 (U20.15 U20.16)
SQB_LO_2A: StratoChovy (J3.10), MC33797 (U20.31 U20.32)
SQB_LO_2B: StratoChovy (J3.9), MC33797 (U20.17 U20.18)